# Altium schematic sheet Power.SchDoc
size A4; SheetNumber: 2; SheetTotal: 7
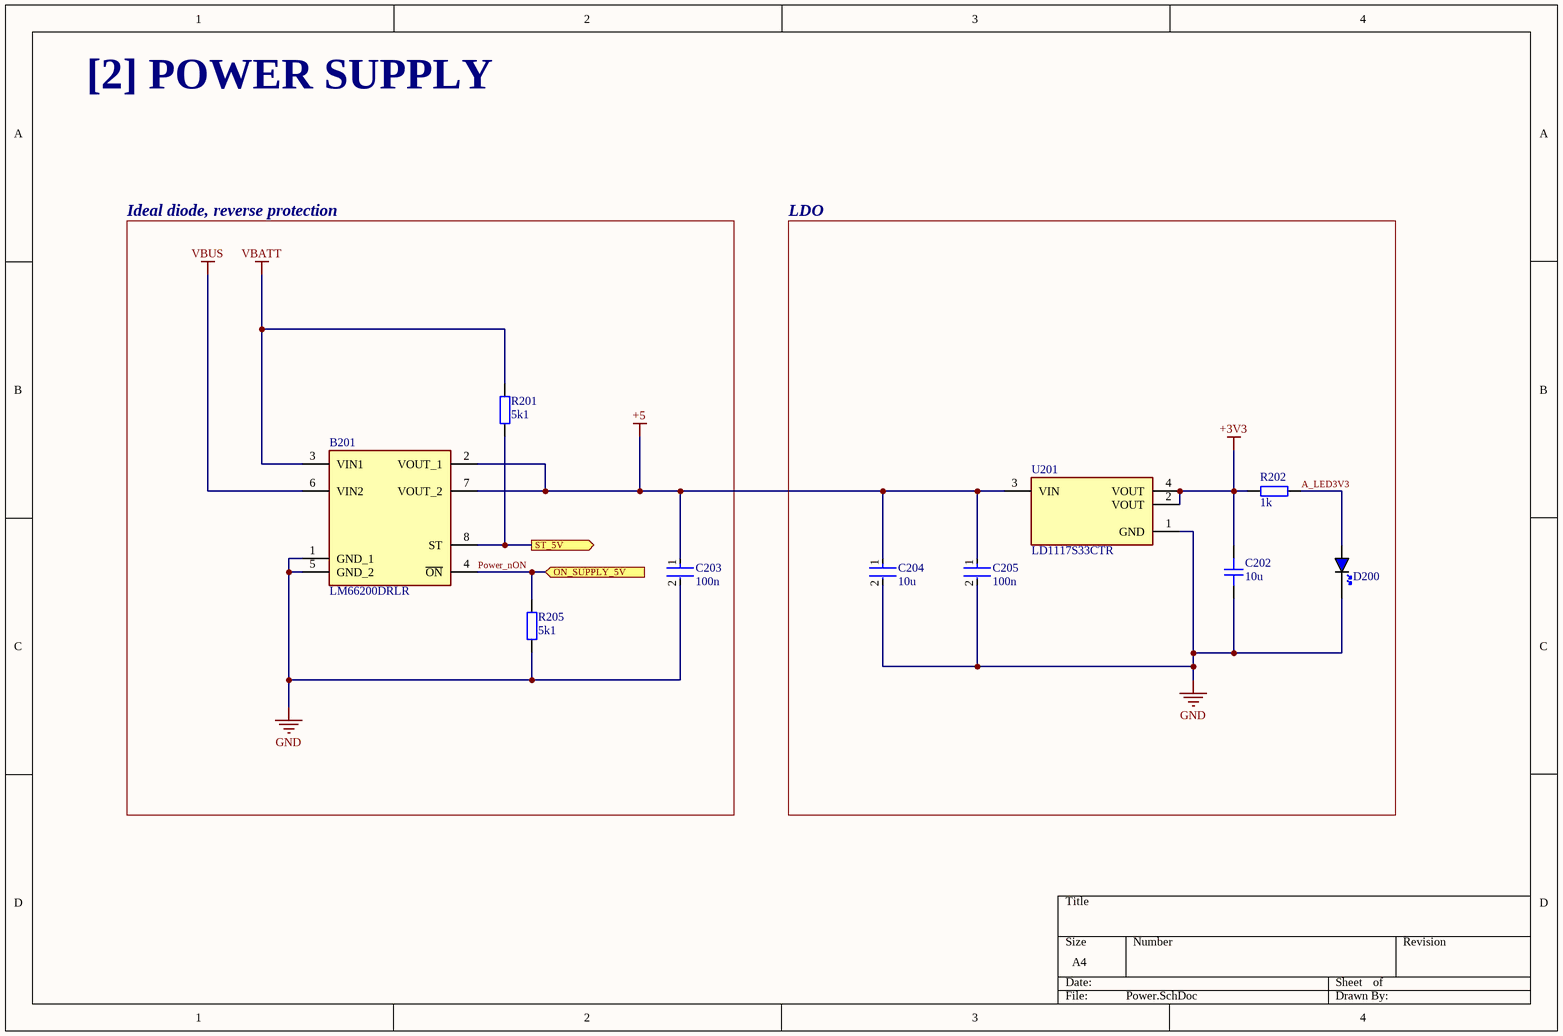
[diagram p0: Power.SchDoc]

## Parts
B201  LM66200DRLR  [SOTFL50P160X60-8N]
C202  10u  [CAP_0603]
C203  100n  [FP-CL779-IPC_C]
C204  10u  [FP-CL10-IPC_C]
C205  100n  [FP-CL779-IPC_C]
D200  BLUE  [LED_0603_BLUE]  (value not drawn)
R201  5k1  [RES_0402]
R202  1k  [RES_0603]
R205  5k1  [RES_0402]
U201  LD1117S33CTR  [FP-SOT-223-0046067_14-MFG]

## Blocks framed on the sheet
Ideal diode, reverse protection: B201 C203 R201 R205
LDO: C202 C204 C205 D200 R202 U201

## Ports
ON_SUPPLY_5V (in), ST_5V (out)

## Nets
+3V3: C202.2 R202.2 U201.2(VOUT) U201.4(VOUT)
+5: B201.2(VOUT_1) B201.7(VOUT_2) C203.1 C204.1 C205.1 U201.3(VIN)
GND: B201.1(GND_1) B201.5(GND_2) C202.1 C203.2 C204.2 C205.2 D200.K R205.2 U201.1(GND)
VBATT: B201.3(VIN1) R201.1
VBUS: B201.6(VIN2)
A_LED3V3: D200.A R202.1
Power_nON: B201.4(~{ON}) R205.1 ; port ON_SUPPLY_5V
ST_5V: B201.8(ST) R201.2 ; port ST_5V

## Notes on the sheet
- [2] POWER SUPPLY

## Library data of the parts
B201 = LM66200DRLR: 1.6-V to 5.5-V, 40-m, 2.5-A, low-IQ, dual ideal diode; Manufacturer_Name: Texas Instruments; Geometry.Height: 0.6mm; Manufacturer_Part_Number: LM66200DRLR; Mouser Part Number: 595-LM66200DRLR; Mouser Price/Stock: https://www.mouser.co.uk/ProductDetail/Texas-Instruments/LM66200DRLR?qs=Rp5uXu7WBW90hnpZAkIOdQ%3D%3D; Arrow Part Number: LM66200DRLR; Arrow Price/Stock: https://www.arrow.com/en/products/lm66200drlr/texas-instruments?region=nac; Datasheet Link: https://www.ti.com/lit/gpn/lm66200
C202 = CAP_0603: Capacitor SMD 0603; Manufacturer: *; Manufacturer Part Number: *; Distributor Link: *; LCSC: *; Rating: *; Dielectric: *
C203 C205 = CMP-13271-002336-1: Cap Ceramic 100nF 50V X7R ±10% SMD 0402 +125°C Paper T/R CL05B104KB54PNC
C204 = CMP-13271-004224-1: Cap Ceramic 10uF 25V X5R ±20% Pad SMD 0603 +85°C T/R CL10A106MA8NRNC; Width: 0.031inch; Voltage Rating: 25V; Length: 0.063inch; Case Code (Metric): 1608; Dielectric: X5R; Termination: Wraparound; Capacitance: 10uF; Lead Free: Lead Free; Mount: Surface Mount; Package Quantity: 1; Case Code (Imperial): 0603; Thickness: 0.035inch; Packaging: Tape and Reel; Contact Plating: Tin; Min Operating Temperature: -55°C; Tolerance: 20%; Max Operating Temperature: 85°C; Case/Package: 0603
D200 = LED_0603_BLUE: LED 0603 BLUE SMD
R201 R205 = RES_0402: Resistor SMD 0402; Manufacturer: *; Manufacturer Part Number: *; Distributor Link: *; LCSC: *
R202 = RES_0603: Resistor SMD 0603; Manufacturer: *; Manufacturer Part Number: *; Distributor Link: *; LCSC: *
U201 = CMP-0244-00307-2: IC REG LINEAR 3.3V 800MA SOT223; Input Bias Current: 5mA; Output Voltage Accuracy: 1%; Dropout Voltage: 1.1V; Power Dissipation: 12W; Polarity: Positive; Min Input Voltage: 5.3V; Quiescent Current: 10mA; Max Output Current: 1.3A; Output Current: 950mA; Number of Regulators: 1; Max Supply Voltage: 15V; Output Type: Fixed; Output Voltage: 3.3V; Number of Terminals: 4; Min Supply Voltage: 3.3V; Termination: SMD/SMT; Mount: Surface Mount; Max Power Dissipation: 12W; Case/Package: SOT-223; Lead Free: Lead Free; Height: 1.8mm; REACH SVHC: No SVHC; Radiation Hardening: No; Width: 3.5mm; Length: 6.5mm; Packaging: Tape and Reel; Max Input Voltage: 15V; Accuracy: 1%; Weight: 0.01lb; Contact Plating: Tin; Max Operating Temperature: 125°C; Number of Pins: 4; Max Output Voltage: 3.3V; Min Operating Temperature: -40°C; Nominal Output Voltage: 3.3V; Package Quantity: 1; Min Output Voltage: 3.3V; Number of Outputs: 1